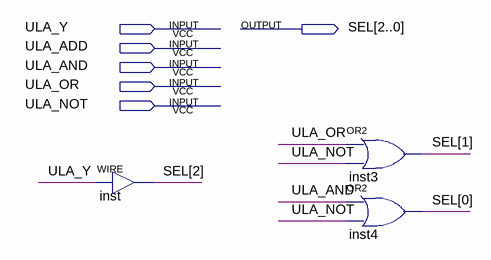
[diagram p0: schematic sheet]
// Quartus schematic ULA_ENCODER.bdf as structural Verilog: 3 symbols, 6 pins
module ULA_ENCODER (
  input  ULA_Y,
  input  ULA_ADD,
  input  ULA_AND,
  input  ULA_OR,
  input  ULA_NOT,
  output [2:0] SEL
);

  assign SEL[2] = ULA_Y;  // WIRE inst
  or inst3 (SEL[1], ULA_OR, ULA_NOT);
  or inst4 (SEL[0], ULA_AND, ULA_NOT);
endmodule
